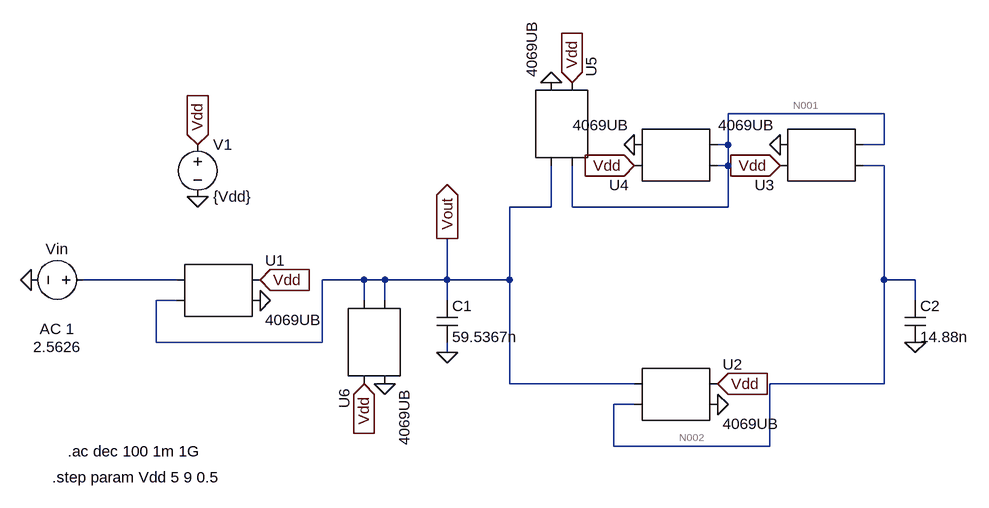
[diagram p0: schematic Q3_1.asc]
* Q3_1.asc
V1 Vdd 0 {Vdd}
* U1: 4069UB (symbol AutoGenerated\4069UB not available, pins judged from their places): pin1=N003 pin2=Vout pin3=Vdd pin4=0
Vin N003 0 2.5626 AC 1
C1 Vout 0 59.5367n
* U2: 4069UB (symbol AutoGenerated\4069UB not available, pins judged from their places): pin1=Vout pin2=N002 pin3=Vdd pin4=0
C2 N002 0 14.88n
* U3: 4069UB (symbol AutoGenerated\4069UB not available, pins judged from their places): pin1=N002 pin2=N001 pin3=Vdd pin4=0
* U4: 4069UB (symbol AutoGenerated\4069UB not available, pins judged from their places): pin1=N001 pin2=N001 pin3=Vdd pin4=0
* U5: 4069UB (symbol AutoGenerated\4069UB not available, pins judged from their places): pin1=N001 pin2=Vout pin3=Vdd pin4=0
* U6: 4069UB (symbol AutoGenerated\4069UB not available, pins judged from their places): pin1=Vout pin2=Vout pin3=Vdd pin4=0
.ac dec 100 1m 1G
.step param Vdd 5 9 0.5
.backanno
.end

* Results of the author's LTspice run, read from the files saved beside the schematic
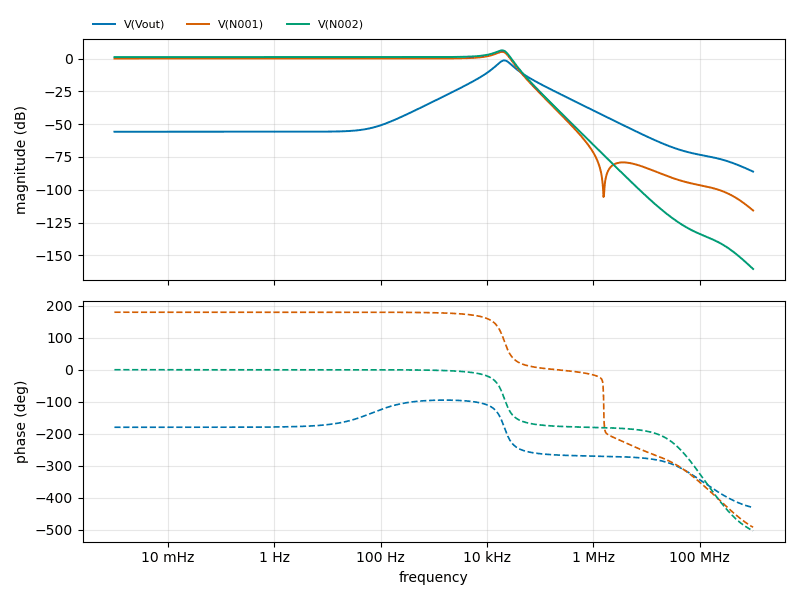
[diagram p1: AC Analysis of Q3_1.asc, plotted from the saved traces]
* AC Analysis, 1 run:
*   V(Vout): -55.75 dB at 1 mHz, -86.15 dB at 1 GHz, peak -1.32 dB at 20.89 kHz, 3 dB below the peak at 15.87 kHz and 28.12 kHz
*   V(N001): 0.11 dB at 1 mHz, -115.80 dB at 1 GHz, peak 5.24 dB at 19.05 kHz, 3 dB below the peak at 11.14 kHz and 24.88 kHz
*   V(N002): 1.19 dB at 1 mHz, -160.42 dB at 1 GHz, peak 6.32 dB at 19.05 kHz, 3 dB below the peak at 11.14 kHz and 24.88 kHz